# EAGLE schematic BuckpuckBreakoutv2a (EAGLE 5.11)
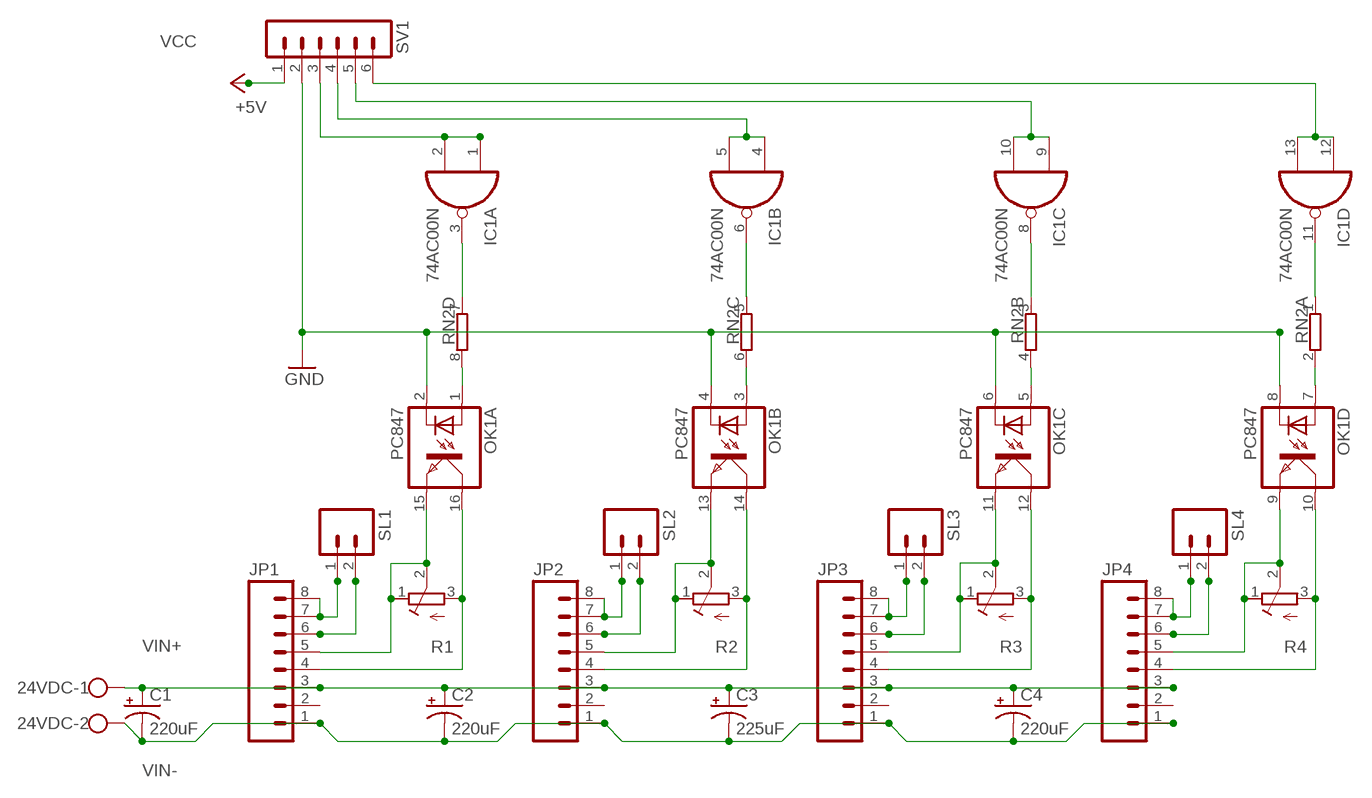
[diagram p0: schematic, sheet 1]

## Parts
24VDC  W237-102  [W237-102]
C1  220uF  CAP_POLPTH3  [CPOL-RADIAL-1000UF-63V]
C2  220uF  CAP_POLPTH3  [CPOL-RADIAL-1000UF-63V]
C3  225uF  CAP_POLPTH3  [CPOL-RADIAL-1000UF-63V]
C4  220uF  CAP_POLPTH3  [CPOL-RADIAL-1000UF-63V]
IC1  74AC00N  [DIL14]
JP1  M08  [1X08]
JP2  M08  [1X08]
JP3  M08  [1X08]
JP4  M08  [1X08]
OK1  PC847  [DIL16]
R1  R-TRIMMT93YB  [RTRIMT93YB]
R2  R-TRIMMT93YB  [RTRIMT93YB]
R3  R-TRIMMT93YB  [RTRIMT93YB]
R4  R-TRIMMT93YB  [RTRIMT93YB]
RN2  E4R  [SIL8]
SL1  M02  [02P]
SL2  M02  [02P]
SL3  M02  [02P]
SL4  M02  [02P]
SV1  MA06-1  [MA06-1]

## Nets
GND: OK1.2(A:C) OK1.4(B:C) OK1.6(C:C) OK1.8(D:C) SV1.2
LED+_1: JP1.7 JP1.8 SL1.1
LED+_2: JP2.7 JP2.8 SL2.1
LED+_3: JP3.7 JP3.8 SL3.1
LED+_4: JP4.7 JP4.8 SL4.1
LED-_1: JP1.6 SL1.2
LED-_2: JP2.6 SL2.2
LED-_3: JP3.6 SL3.2
LED-_4: JP4.6 SL4.2
N$1: IC1.1(A:I0) IC1.2(A:I1) SV1.3
N$2: IC1.4(B:I0) IC1.5(B:I1) SV1.4
N$3: IC1.9(C:I0) IC1.10(C:I1) SV1.5
N$4: IC1.12(D:I0) IC1.13(D:I1) SV1.6
N$5: IC1.3(A:O) RN2.7
N$6: OK1.1(A:A) RN2.8
N$7: OK1.3(B:A) RN2.6
N$8: IC1.6(B:O) RN2.5
N$9: JP1.5 OK1.15(A:EMIT) R1.1(A) R1.2(S)
N$10: JP1.4 OK1.16(A:COL) R1.3(E)
N$11: JP2.5 OK1.13(B:EMIT) R2.1(A) R2.2(S)
N$12: JP2.4 OK1.14(B:COL) R2.3(E)
N$13: JP3.5 OK1.11(C:EMIT) R3.1(A) R3.2(S)
N$14: JP3.4 OK1.12(C:COL) R3.3(E)
N$15: JP4.5 OK1.9(D:EMIT) R4.1(A) R4.2(S)
N$16: JP4.4 OK1.10(D:COL) R4.3(E)
N$17: IC1.8(C:O) RN2.3
N$18: OK1.5(C:A) RN2.4
N$19: OK1.7(D:A) RN2.2
N$20: IC1.11(D:O) RN2.1
VCC: SV1.1 ; supply symbol labelled +5V
VIN+: 24VDC.1 C1.1(+) C2.1(+) C3.1(+) C4.1(+) JP1.3 JP2.3 JP3.3 JP4.3
VIN-: 24VDC.2 C1.2(-) C2.2(-) C3.2(-) C4.2(-) JP1.1 JP2.1 JP3.1 JP4.1
Unconnected: JP1.2 JP2.2 JP3.2 JP4.2

## Power pins joined to a net without a drawn wire
GND: IC1.7(P:GND)
VCC: IC1.14(P:VCC)

## Library data of the parts
24VDC = con-wago-500:W237-102: WAGO SCREW CLAMP
C1-C4 = SparkFun:CAP_POL: Capacitor Polarized These are standard SMD and PTH capacitors. Normally 10uF, 47uF, and 100uF in electrolytic and tantalum varieties. Always verify the external diameter of the through hole cap, it varies with capacity, voltage, and manufacturer. The EIA devices should be standard.
IC1 = 74xx-eu:74*00: Quad 2-input NAND gate
JP1-JP4 = SparkFun:M08: Header 8 Standard 8-pin 0.1" header. Use with straight break away headers (SKU : PRT-00116), right angle break away headers (PRT-00553), swiss pins (PRT-00743), machine pins (PRT-00117), and female headers (PRT-00115).
OK1 = optocoupler:PC847: SHARP OPTO COUPLER; OC_FARNELL: 9707735; OC_NEWARK: unknown
R1-R4 = resistor:R-TRIMM: Trimm resistor
RN2 = resistor-sil:E4R: SIL RESISTOR; OC_FARNELL: unknown; OC_NEWARK: unknown
SL1-SL4 = con-amp-quick:M02: AMP QUICK CONNECTOR
SV1 = con-lstb:MA06-1: PIN HEADER; OC_FARNELL: unknown; OC_NEWARK: unknown